# Altium schematic sheet 24.067.SchDoc
size A4
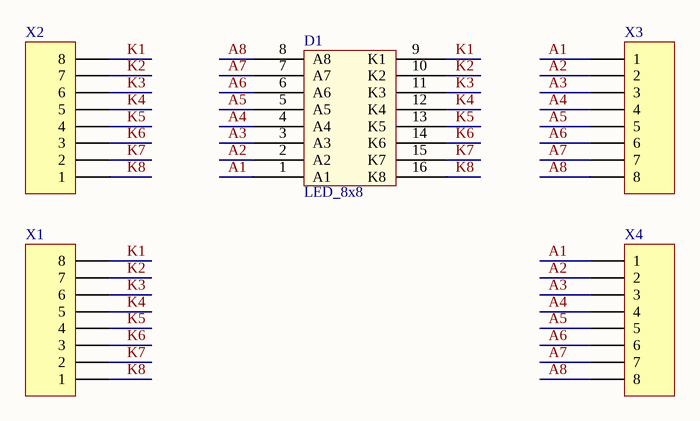
[diagram p0: 24.067.SchDoc]

## Parts
D1  LED_8x8  [LED_8x8]
X1  Header 8  [HDR1X8]  (value not drawn)
X2  Header 8  [HDR1X8]  (value not drawn)
X3  Header 8  [HDR1X8]  (value not drawn)
X4  Header 8  [HDR1X8]  (value not drawn)

## Nets
A1: D1.1(A1) X3.1 X4.1
A2: D1.2(A2) X3.2 X4.2
A3: D1.3(A3) X3.3 X4.3
A4: D1.4(A4) X3.4 X4.4
A5: D1.5(A5) X3.5 X4.5
A6: D1.6(A6) X3.6 X4.6
A7: D1.7(A7) X3.7 X4.7
A8: D1.8(A8) X3.8 X4.8
K1: D1.9(K1) X1.8 X2.8
K2: D1.10(K2) X1.7 X2.7
K3: D1.11(K3) X1.6 X2.6
K4: D1.12(K4) X1.5 X2.5
K5: D1.13(K5) X1.4 X2.4
K6: D1.14(K6) X1.3 X2.3
K7: D1.15(K7) X1.2 X2.2
K8: D1.16(K8) X1.1 X2.1

## Library data of the parts
X1-X4 = Header 8: Header, 8-Pin; LatestRevisionDate: 17-Jul-2002; LatestRevisionNote: Re-released for DXP Platform.; Publisher: Altium Limited